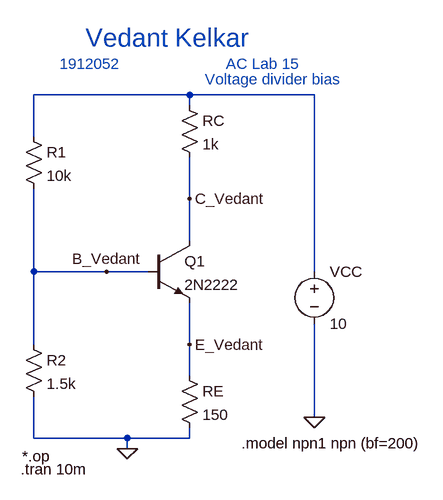
[diagram p0: schematic Draft33.asc]
Draft33.asc, the LTspice schematic file:
Version 4
SHEET 1 880 752
WIRE 224 160 -16 160
WIRE 416 160 224 160
WIRE 224 176 224 160
WIRE -16 224 -16 160
WIRE 224 320 224 256
WIRE 224 384 224 320
WIRE -16 432 -16 304
WIRE 96 432 -16 432
WIRE 160 432 96 432
WIRE 416 432 416 160
WIRE -16 544 -16 432
WIRE 224 544 224 480
WIRE 224 592 224 544
WIRE 416 656 416 512
WIRE -16 688 -16 624
WIRE 128 688 -16 688
WIRE 224 688 224 672
WIRE 224 688 128 688
WIRE 128 704 128 688
FLAG 224 544 E_Vedant
FLAG 224 320 C_Vedant
FLAG 96 432 B_Vedant
FLAG 416 656 0
FLAG 128 704 0
SYMBOL res -32 208 R0
SYMATTR InstName R1
SYMATTR Value 10k
SYMBOL res -32 528 R0
SYMATTR InstName R2
SYMATTR Value 1.5k
SYMBOL res 208 160 R0
SYMATTR InstName RC
SYMATTR Value 1k
SYMBOL res 208 576 R0
SYMATTR InstName RE
SYMATTR Value 150
SYMBOL npn 160 384 R0
SYMATTR InstName Q1
SYMATTR Value 2N2222
SYMBOL voltage 416 416 R0
WINDOW 123 0 0 Left 0
WINDOW 39 0 0 Left 0
SYMATTR InstName VCC
SYMATTR Value 10
TEXT 64 72 Left 4 ;Vedant Kelkar
TEXT 24 112 Left 2 ;1912052
TEXT 280 112 Left 2 ;AC Lab 15
TEXT 304 696 Left 2 !.model npn1 npn (bf=200)
TEXT -34 716 Left 2 !*.op
TEXT 248 136 Left 2 ;Voltage divider bias
TEXT -36 736 Left 2 !.tran 10m

The netlist it stands for:
* Draft33.asc
R1 N001 B_Vedant 10k
R2 B_Vedant 0 1.5k
RC N001 C_Vedant 1k
RE E_Vedant 0 150
Q1 C_Vedant B_Vedant E_Vedant 0 2N2222
VCC N001 0 10
.model NPN NPN
.model PNP PNP
.lib standard.bjt
* Vedant Kelkar
* 1912052
* AC Lab 15
.model npn1 npn (bf=200)
*.op
* Voltage divider bias
.tran 10m
.backanno
.end